# Altium schematic sheet HDMI_IN.SchDoc
size A; SheetNumber: 4; SheetTotal: 12
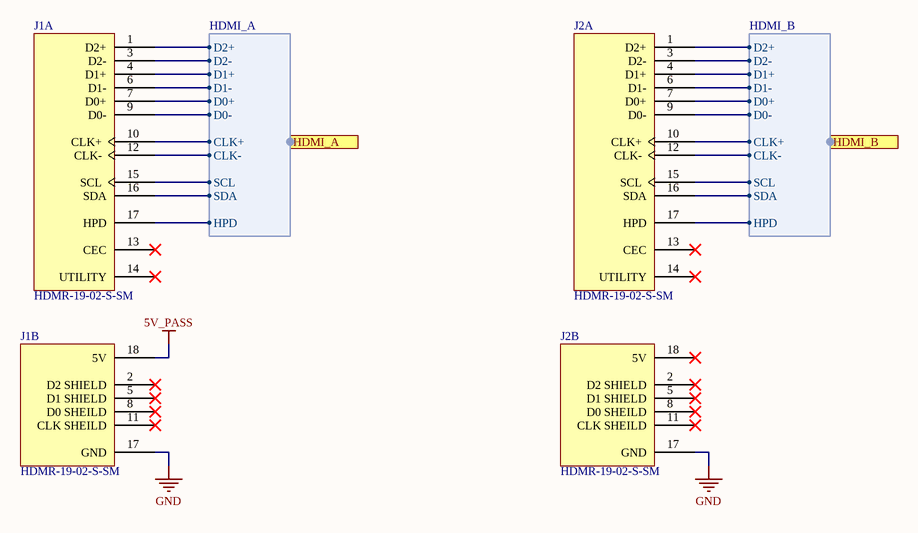
[diagram p0: HDMI_IN.SchDoc]

## Parts
J1  HDMR-19-02-S-SM  [SAMTEC_HDMR-19-02-S-SM]  (parts A,B of 2)
J2  HDMR-19-02-S-SM  [SAMTEC_HDMR-19-02-S-SM]  (parts A,B of 2)

## Ports
HDMI_A (harness HDMI_A, see HDMI[2B], HDMI_SWITCH[1A]), HDMI_B (harness HDMI_B, see HDMI[2B], HDMI_SWITCH[1B])

## Harnesses
HDMI_A: SCL, SDA, HPD, D0+, D0-, D1+, D1-, D2+, D2-, CLK+, CLK-
HDMI_B: SCL, SDA, HPD, D0+, D0-, D1+, D1-, D2+, D2-, CLK+, CLK-

## Nets
5V_PASS: J1.18(5V)
GND: J1.17(GND) J2.17(GND)
NetJ1_1: J1.1(D2+) ; port HDMI_A.D2+
NetJ1_3: J1.3(D2-) ; port HDMI_A.D2-
NetJ1_4: J1.4(D1+) ; port HDMI_A.D1+
NetJ1_6: J1.6(D1-) ; port HDMI_A.D1-
NetJ1_7: J1.7(D0+) ; port HDMI_A.D0+
NetJ1_9: J1.9(D0-) ; port HDMI_A.D0-
NetJ1_10: J1.10(CLK+) ; port HDMI_A.CLK+
NetJ1_12: J1.12(CLK-) ; port HDMI_A.CLK-
NetJ1_15: J1.15(SCL) ; port HDMI_A.SCL
NetJ1_16: J1.16(SDA) ; port HDMI_A.SDA
NetJ1_17: J1.17(HPD) ; port HDMI_A.HPD
NetJ2_1: J2.1(D2+) ; port HDMI_B.D2+
NetJ2_3: J2.3(D2-) ; port HDMI_B.D2-
NetJ2_4: J2.4(D1+) ; port HDMI_B.D1+
NetJ2_6: J2.6(D1-) ; port HDMI_B.D1-
NetJ2_7: J2.7(D0+) ; port HDMI_B.D0+
NetJ2_9: J2.9(D0-) ; port HDMI_B.D0-
NetJ2_10: J2.10(CLK+) ; port HDMI_B.CLK+
NetJ2_12: J2.12(CLK-) ; port HDMI_B.CLK-
NetJ2_15: J2.15(SCL) ; port HDMI_B.SCL
NetJ2_16: J2.16(SDA) ; port HDMI_B.SDA
NetJ2_17: J2.17(HPD) ; port HDMI_B.HPD

Not connected (* = marked no-connect by the designer): J1 2(D2_SHIELD)* 5(D1_SHIELD)* 8(D0_SHEILD)* 11(CLK_SHEILD)* 13(CEC)* 14(UTILITY)*; J2 2(D2_SHIELD)* 5(D1_SHIELD)* 8(D0_SHEILD)* 11(CLK_SHEILD)* 13(CEC)* 14(UTILITY)* 18(5V)*

## Library data of the parts
J1 J2 = SAMTEC_HDMR-19-02-S-SM: Conn HDMI RCP 19 POS 0.5mm Solder RA SMD 19 Terminal 1 Port